# EAGLE design DCC-motor (EAGLE 7.4.0)
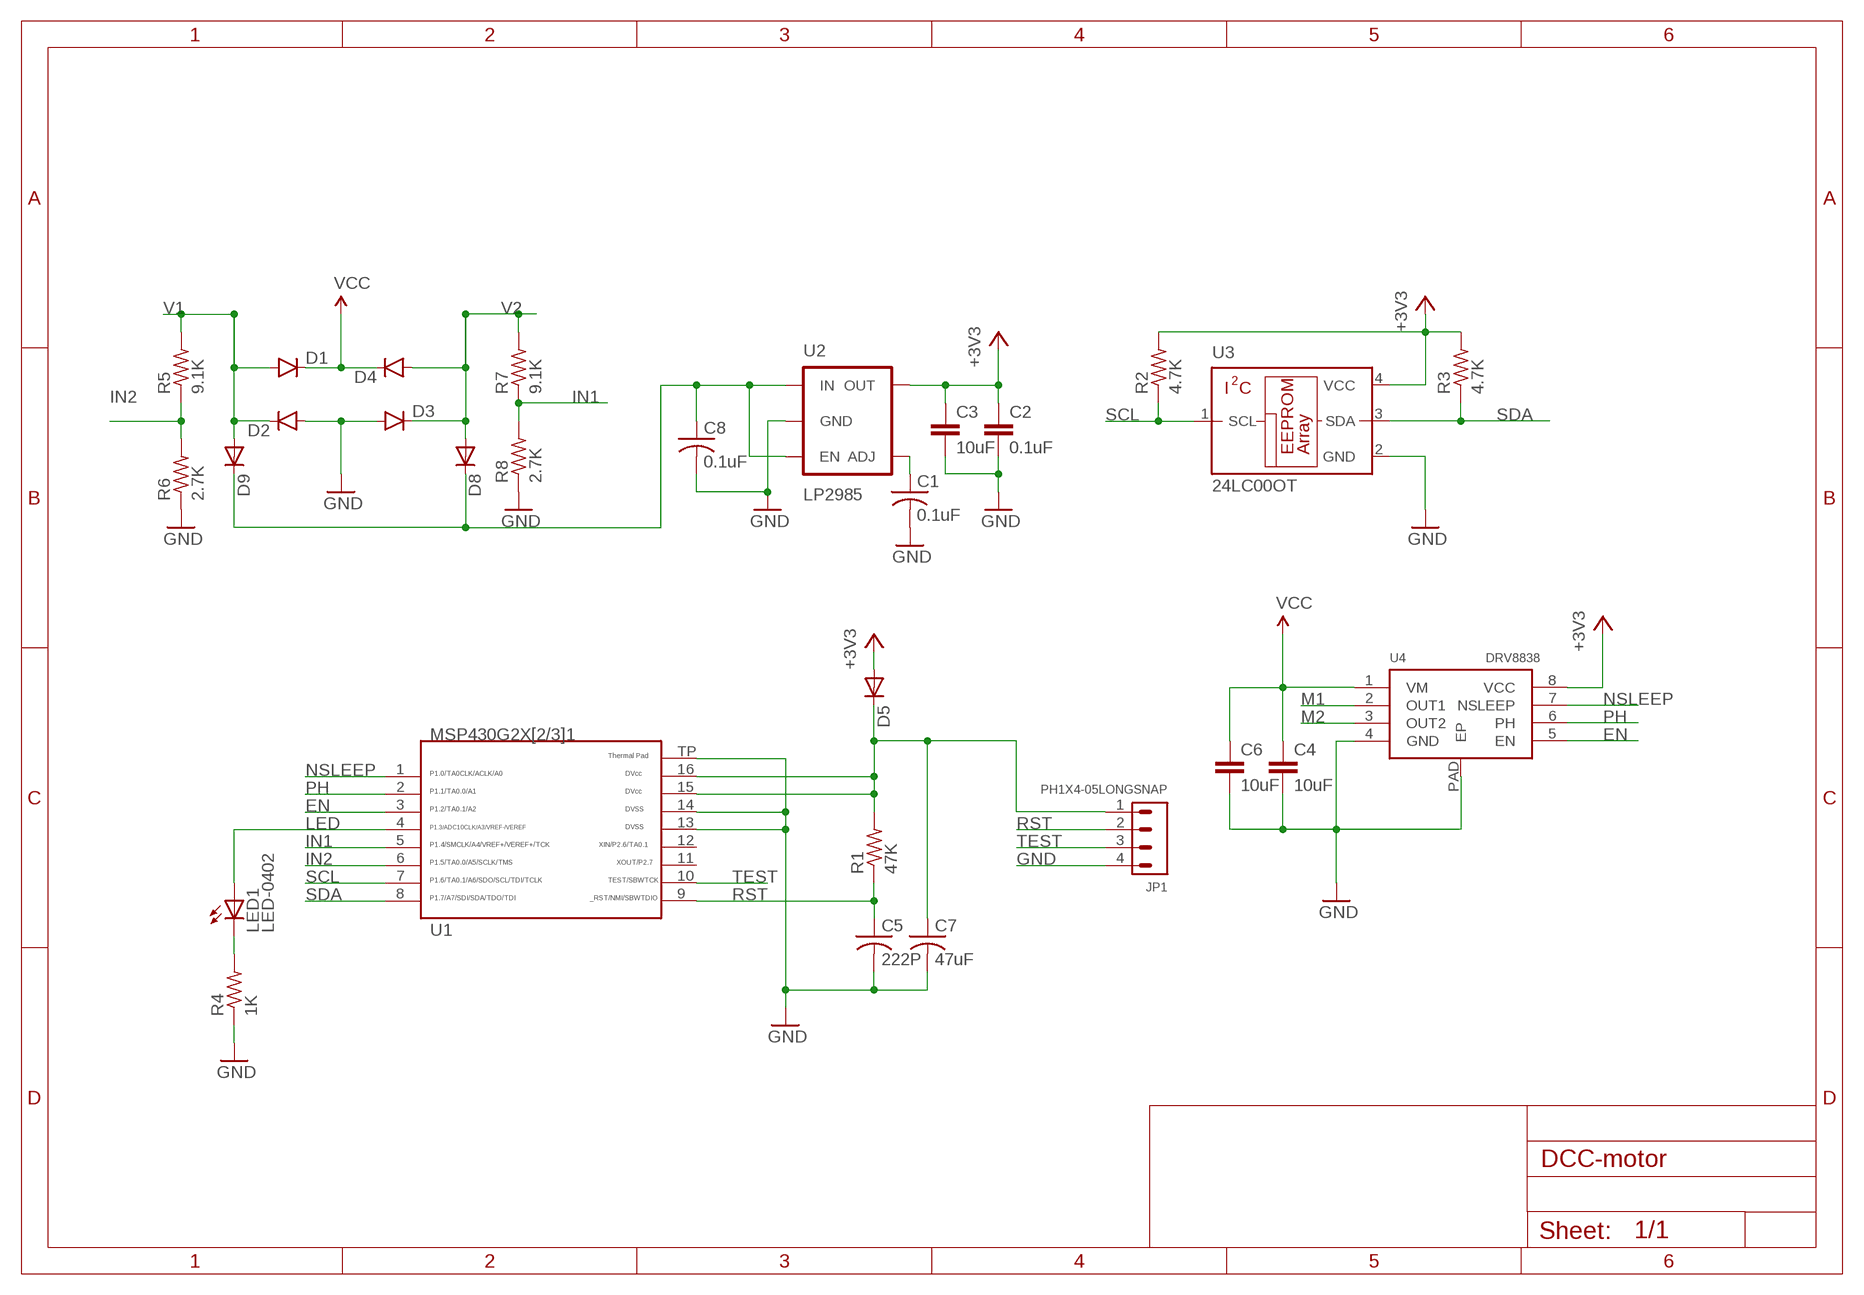
[diagram p0: schematic, sheet 1]

## Parts
C1  0.1uF  C-USC0402  [C0402]
C2  0.1uF  CAP0603-CAP  [0603-CAP]
C3  10uF  CAP0603-CAP  [0603-CAP]
C4  10uF  CAP0603-CAP  [0603-CAP]
C5  222P  C-USC0402  [C0402]
C6  10uF  CAP0603-CAP  [0603-CAP]
C7  47uF  C-USC0402  [C0402]
C8  0.1uF  C-USC0402  [C0402]
D1  DIODESOD123  [SOD-123]
D2  DIODESOD123  [SOD-123]
D3  DIODESOD123  [SOD-123]
D4  DIODESOD123  [SOD-123]
D5  DIODE-SOD523  [SOD523]
D8  DIODE-SOD523  [SOD523]
D9  DIODE-SOD523  [SOD523]
JP1  PH1X4-05LONGSNAP  [PHLS005-1-4]
LED1  LED-0402  [0402-LED]
R1  47K  R-US_R0402  [R0402]
R2  4.7K  R-US_R0402  [R0402]
R3  4.7K  R-US_R0402  [R0402]
R4  1K  R-US_R0402  [R0402]
R5  9.1K  R-US_R0402  [R0402]
R6  2.7K  R-US_R0402  [R0402]
R7  9.1K  R-US_R0402  [R0402]
R8  2.7K  R-US_R0402  [R0402]
U1  G2X[2/3]1---RSA16  [RSA16]
U2  LP2985  AP2202-ADJ  [SOT23-5]
U3  24LC00OT  [SOT23-5L]
U4  DRV8838  [WSON-8-PAD]

## Nets
+3V3: C2.1 C3.1 D5.A R2.2 R3.2 U2.5(OUT) U3.4(VCC) U4.8(VCC)
EN: U1.3 U4.5(EN)
GND: C1.2 C2.2 C3.2 C4.2 C5.2 C6.2 C7.2 C8.2 D2.A D3.A JP1.4 R4.1 R6.1 R8.1 U1.13 U1.14 U1.TP U2.2(GND) U3.2(GND) U4.4(GND) U4.PAD(EP)
IN1: R7.1 R8.2 U1.5
IN2: R5.1 R6.2 U1.6
LED: LED1.A U1.4
M1: U4.2(OUT1)
M2: U4.3(OUT2)
N$1: C1.1 U2.4(ADJ)
N$2: C8.1 D8.C D9.C U2.1(IN) U2.3(EN)
N$3: LED1.C R4.2
N$4: C7.1 D5.C JP1.1 R1.2 U1.15 U1.16
NSLEEP: U1.1 U4.7(NSLEEP)
PH: U1.2 U4.6(PH)
RST: C5.1 JP1.2 R1.1 U1.9
SCL: R2.1 U1.7 U3.1(SCL)
SDA: R3.1 U1.8 U3.3(SDA)
TEST: JP1.3 U1.10
V1: D1.A D2.C D9.A R5.2
V2: D3.C D4.A D8.A R7.2
VCC: C4.1 C6.1 D1.C D4.C U4.1(VM)
Unconnected: U1.11 U1.12

## Library data of the parts
C1 C5 C7 C8 = adafruit:C-US: CAPACITOR, American symbol
C2-C4 C6 = SparkFun-Passives:CAP: Capacitor Standard 0603 ceramic capacitor, and 0.1" leaded capacitor.
D1-D4 = SparkFun-DiscreteSemi:DIODE: Diode These are standard reverse protection diodes and small signal diodes. SMA package can handle up to about 1A. SOD-323 can handle about 200mA. What the SOD-323 package when ordering, there are some mfgs out there that are 5-pin packages.
D5 D8 D9 = RoboJackets-Diodes:DIODE-: DIODE
JP1 = pel_hdr:PH1X4
LED1 = pel_dipol_comp:LED
R1-R8 = adafruit:R-US_: RESISTOR, American symbol
U1 = TI_MSP430_v16:G2X[2/3]1---RSA16: MSP430G2X[2/3]1 QFN (RSA) 16 Pin Package http://focus.ti.com/docs/prod/folders/print/msp430g2221.html
U2 = SparkFun-PowerIC:AP2202-ADJ: AP2202 Adjustable LDO Diodes Inc small, low-cost LDO 150mA, 13.2V, less than 200mV dropout; PROD_ID: VREG-12189; VALUE: AP2202-ADJ
U3 = microchip:24*00: Serial EEPROM 128 bit, I2C (AA = 1.8 V/LC = 2.5 V/C = 5.0 V); MF: MICROCHIP; MPN: 24LC00T-I/OT; OC_FARNELL: 9757864; OC_NEWARK: 62K0574
U4 = SparkFun-PowerIC:DRV8838

## Board
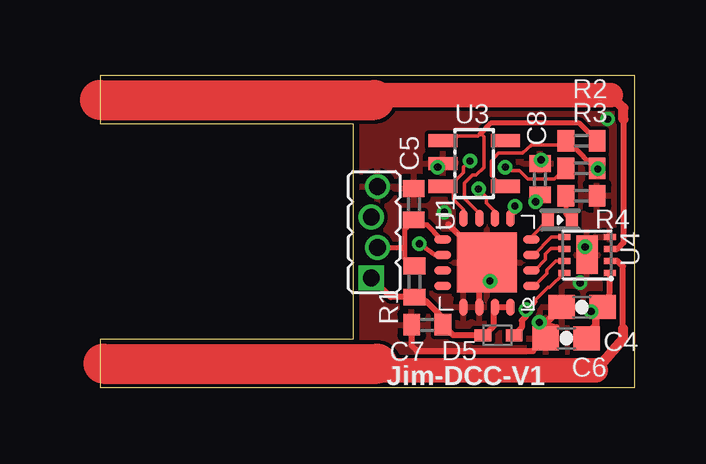
[diagram p1: board, top side]
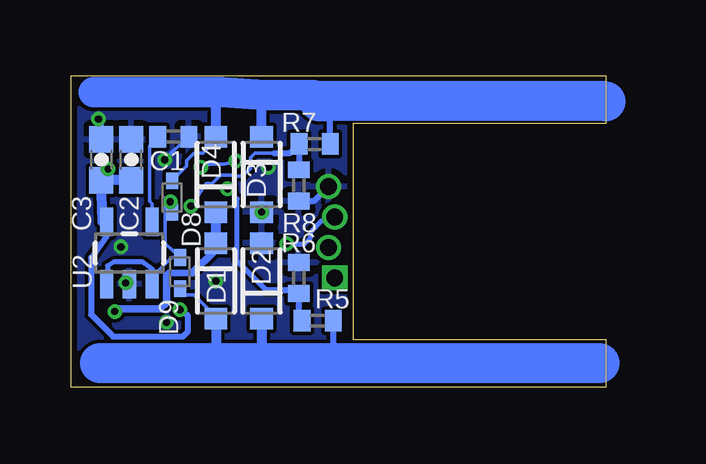
[diagram p2: board, bottom side, seen from below]

Size 22.3 x 13 mm. Coordinates in mm from the lower left corner, seen from the top.
Outline: 0,0 22.3,0 22.3,13 0,13 0,11 10.54,11 10.54,2 0,2 0,0
Copper layers (1*16): Top 0.035mm / dielectric 1.5mm / Bottom 0.035mm
Design rules "6mil": minimum track width 6mil, minimum drill 6mil, track to track 6mil, track to pad 6mil, pad to pad 6mil, via to via 6mil, smd to smd 6mil, copper to edge 10mil, drill to drill 8mil, minimum pad ring 6mil, minimum via ring 6mil, stop-mask expansion 4mil, vias tented up to drill 15mil, thermal gap 10mil

### Footprints (pad centres in the part's own frame; a part is rotated, then mirrored left to right if it is on the bottom)
C0402 = smd 0.7 x 0.9: 1 -0.65,0; 2 0.65,0
0603-CAP = smd 1.1 x 1: 1 -0.85,0; 2 0.85,0
SOD-123 = smd 0.9 x 0.95: A 1.575,0; C -1.575,0
SOD523 = smd 0.7 x 0.5: A 0.7,0; C -0.6,0
PHLS005-1-4 = drill 0.7 pad 1.016 square: 1 0,0.127 | drill 0.7 pad 1.016: 2 1.27,-0.127; 3 2.54,0.127; 4 3.81,-0.127
0402-LED = smd 0.5 x 0.6: A 0.5,0; C -0.5,0
R0402 = smd 0.7 x 0.9: 1 -0.65,0; 2 0.65,0
RSA16 = smd 0.7 x 0.35: 1 -1.85,0.975; 2 -1.85,0.325; 3 -1.85,-0.325; 4 -1.85,-0.975; 9 1.85,-0.975; 10 1.85,-0.325; 11 1.85,0.325; 12 1.85,0.975 | smd 0.35 x 0.7: 5 -0.975,-1.85; 6 -0.325,-1.85; 7 0.325,-1.85; 8 0.975,-1.85; 13 0.975,1.85; 14 0.325,1.85; 15 -0.325,1.85; 16 -0.975,1.85 | smd 2.5 x 2.5: TP 0,0
SOT23-5 = smd 0.55 x 1.2: 1 -0.95,-1.3; 2 0,-1.3; 3 0.95,-1.3; 4 0.95,1.3; 5 -0.95,1.3
SOT23-5L = smd 0.55 x 1.2: 1 -0.95,-1.3; 2 0,-1.3; 3 0.95,-1.3; 4 0.95,1.3; 5 -0.95,1.3
WSON-8-PAD = smd 0.25 x 0.5: 1 -0.75,-0.95; 2 -0.25,-0.95; 3 0.25,-0.95; 4 0.75,-0.95; 5 0.75,0.95; 6 0.25,0.95; 7 -0.25,0.95; 8 -0.75,0.95 | smd 1.6 x 0.9: PAD 0,0

### Placement (x,y rotation side)
C1  18.03,10.46 0 bottom
C2  19.79,9.5 90 bottom
C3  21.03,9.5 90 bottom
C4  20.09,3.35 180 top
C5  13.08,7.65 90 top
C6  19.43,2.06 180 top
C7  13.64,2.62 180 top
C8  18.34,8.69 90 top
D1  16.26,4.45 270 bottom
D2  14.35,4.45 90 bottom
D3  14.35,8.89 270 bottom
D4  16.26,8.89 90 bottom
D5  16.56,2.18 0 top
D8  18.08,7.92 90 bottom
D9  17.75,4.83 270 bottom
JP1  11.43,4.57 90 top
LED1  19.18,6.99 180 top
R1  13.11,4.42 270 top
R2  20.07,10.29 180 top
R3  20.07,9.14 0 top
R4  20.07,8 180 top
R5  12.01,2.79 0 bottom
R6  12.8,4.57 270 bottom
R7  12.14,10.16 0 bottom
R8  12.8,8.43 90 bottom
U1  16.13,5.21 180 top
U2  19.86,5.61 0 bottom
U3  15.6,9.35 270 top
U4  20.29,5.54 90 top

### Tracks (layer width: path | path; a pad name or v marks a point on that pad's centre or on a via)
+3V3  (via drill 0.3)
  Top 0.152: 18.14,3.58 18.14,3.63 18.67,4.17 18.72,4.17 U4.8 | R2.2 19.24,10.11 17.98,10.11 17.6,9.78 16.61,9.78 16.31,9.45 16.31,8.84 16.72,8.4 U3.4
  Top 0.203: 18.14,3.58 17.93,3.33 v17.75,3.25 | v20.75,9.12 20.85,9.14 R3.2 20.65,9.14 19.68,10.11 19.24,10.11
  Top 0.254: 17.58,3.24 v17.75,3.25 17.75,2.97 17.58,2.79 17.58,2.5 D5.A 17.3,2.18 17.5,2.39
  Bottom 0.203: v20.75,9.12 21.21,8.83 C3.1
  Bottom 0.254: 20.98,6.91 U2.5 20.81,6.31 21.46,5.41 21.46,3.05 20.55,2.13 17.63,2.13 17.42,2.34 17.42,3 v17.75,3.25
  Bottom 0.406: 20.98,6.91 C3.1 C2.1
EN
  Top 0.152: U1.3 18.08,5.53 18.82,6.27 19.33,6.27 U4.5
GND  (via drill 0.3)
  Top 0.152: 14.35,9.53 14.35,9.47 v14.07,9.2
  Top 0.203: 15.8,4.88 15.82,4.88 v16.26,4.45 | U3.2 14.53,9.35 14.35,9.53
  Top 0.254: U1.14 15.8,4.88 U1.TP 14.53,6.81 14.5,6.81 | v18.31,2.72 19.04,2.52 C6.2 18.05,1.52 13.21,1.52 12.99,1.74 C7.2
  Top 0.305: C6.2 18.58,2.69 C4.2
  Bottom 0.152: C1.2 17.42,10.46 v18.39,9.5
  Bottom 0.254: R8.1 12.16,7.78 JP1.4 | C3.2 21.03,11.07 v21.16,11.2
  Bottom 0.406: U2.2 20.02,4.31 v20.02,4.37
  other vias: 14.35,7.32 20.22,5.87 14.35,7.32
  pour Bottom: -1.14,15.24 25.4,15.24 25.4,-1.27 -1.4,-1.27 -1.4,2.54 9.78,2.54 9.78,8.89 -1.14,8.89
  pour Top: -1.14,15.24 25.4,15.24 25.4,-1.4 -1.27,-1.4 -1.27,2.54 10.03,2.54 10.03,9.53 -1.14,9.53
IN1  (via drill 0.3)
  Top 0.152: 17.1,7.27 17.31,7.27 v17.3,7.57
  Top 0.203: U1.5 17.1,7.27
  Bottom 0.152: 13.82,9.78 14.63,9.78 14.81,9.6 14.81,9.14 15.14,8.81 15.44,8.81 15.62,8.87 16.05,8.87 16.41,8.51 16.66,8.51 v17.3,7.57
  Bottom 0.254: 13.82,9.78 13.17,9.78 R7.1 12.79,9.09 R8.2
IN2  (via drill 0.3)
  Top 0.152: U1.6 16.45,7.35 16.1,7.7 16.1,7.95 v15.77,8.28
  Bottom 0.152: 15.37,7.87 v15.77,8.28
  Bottom 0.203: 14.16,4.08 15.37,5.28 15.37,7.87
  Bottom 0.254: R5.1 12.8,2.93 R6.2 12.96,4.08 14.16,4.08
LED
  Top 0.152: U1.4 17.98,6.29 LED1.A
M1
  Top 0.254: 21.79,2.46 21.79,5.05 21.56,5.29 U4.2
  Top 0.406: 21.79,2.46 21.79,2.01 20.68,0.71
  Top 1.016: 20.68,0.71 11.84,0.71 11.56,0.99
  Top 1.676: 0.13,0.99 11.56,0.99
M2
  Top 0.254: 21.82,11.18 21.82,6.04 21.56,5.79 U4.3
  Top 0.406: 21.82,11.18 21.82,11.66 21.29,12.19
  Top 1.016: 21.29,12.19 11.63,12.19 11.43,11.99
  Top 1.676: 0,11.99 11.43,11.99
N$1
  Bottom 0.152: U2.4 18.91,7.66 19.02,7.77 19.02,10.07 C1.1
N$2  (via drill 0.3)
  Top 0.152: C8.1 18.43,8.04 v18.16,7.75
  Bottom 0.152: U2.3 18.72,4.51 18.72,4.8 18.09,5.43 D9.C 18.36,6.01 18.36,7.59 18.1,7.59 D8.C 18.41,7.9 v18.16,7.75
  Bottom 0.203: U2.3 18.91,4.94 19.3,5.23 20.52,5.23 20.78,5.08 20.78,4.35 U2.1
N$3
  Top 0.203: R4.2 19.42,7.25 LED1.C
N$4
  Top 0.254: U1.16 U1.15 16.41,3.31 16.41,2.56 16.03,2.18 D5.C 14.72,2.18 C7.1 14.29,2.91 13.59,3.61 13.27,3.61 R1.2 12.11,3.77 JP1.1
NSLEEP
  Top 0.152: U1.1 18.1,4.23 18.62,4.75 18.62,4.9 19,5.29 U4.7
PH
  Top 0.152: U1.2 18.11,4.88 18.57,5.33 18.57,5.56 18.8,5.79 U4.6
RST
  Top 0.203: U1.9 14.24,6.18 13.64,6.78 13.27,6.78 13.27,6.81 C5.1 12.7,6.61 12.7,5.74 | R1.1 12.89,5.07 12.78,5.18 12.78,5.31 12.7,5.38 12.7,5.74 | JP1.2 12.6,5.84 12.7,5.74
SCL
  Top 0.152: U1.7 15.8,7.26 15.19,7.87 15.19,8.53 15.52,8.87 15.67,8.87 16,9.17 16,10.46 15.85,10.59 15.75,10.49 14.91,10.49 14.72,10.3 U3.1
  Top 0.203: R2.1 19.99,11.02 16.28,11.02 15.85,10.59
SDA  (via drill 0.3)
  Top 0.152: 14.69,8.38 U3.3 | U1.8 15.15,7.43 14.73,7.85 14.73,8.15 14.76,8.18 14.51,8.18 U3.3 | 15.19,9.25 v15.42,9.45 15.14,9.2 15.14,8.97 14.57,8.4 U3.3 | R3.1 19.41,9.14 18.95,8.69 17.83,8.69 17.48,9.04 17.04,9.04 v16.89,9.2
  Bottom 0.152: v15.42,9.45 15.9,9.32 16.48,9.32 v16.89,9.2
TEST  (via drill 0.3)
  Top 0.203: U1.10 13.95,5.53 v13.31,5.99
  Bottom 0.203: v13.31,5.99 12.57,5.99 12.32,6.25 12.32,6.48 11.84,6.96 11.51,6.96 JP1.3
V1
  Bottom 0.152: D1.A 16.26,2.95 17.17,3.86 17.52,3.86 D9.A
  Bottom 0.254: R5.2 11.36,1.08 11.43,1.02
  Bottom 0.406: 12.98,1.04 12.95,1.02 | D2.C 14.35,1.14 14.48,1.02 | D1.A 16.26,1.02
  Bottom 1.676: 0.25,1.02 11.43,1.02 12.95,1.02 14.48,1.02 16.26,1.02 21.08,1.02
V2
  Bottom 0.152: 16.26,10.34 D4.A 16.54,10.19 16.54,10.03 16.79,9.78 17.17,9.78 17.48,9.47 17.48,9.23 D8.A
  Bottom 0.254: R7.2 11.49,11.74 11.68,11.94
  Bottom 0.406: D3.C 14.35,12.06 14.22,12.19 | D4.A 16.26,11.94 16.03,12.32
  Bottom 1.27: 11.94,11.94 12.19,12.19 14.22,12.19 16.03,12.32 21.36,12.32
  Bottom 1.676: 0,11.94 11.68,11.94 11.94,11.94
VCC  (via drill 0.3)
  Top 0.254: U4.1 21.22,3.6 C4.1
  Top 0.305: C6.1 20.28,2.2 20.68,2.59 20.68,3.09 C4.1
  Top 0.406: v20.47,3.17 C4.1
  Bottom 0.279: 17.25,4.78 18.19,4.78
  Bottom 0.305: 16.26,5.92 16.26,5.77 17.25,4.78 | 18.19,4.78 18.31,4.65 18.31,3.56 18.59,3.28 20.37,3.28 v20.47,3.17
  Bottom 0.406: 16.47,7.1 D4.C D1.C 16.26,5.92

### Text on the board
tPlace: Jim-DCC-V1